# EAGLE design nRF2401A-Chip-v11 (EAGLE 6.4)
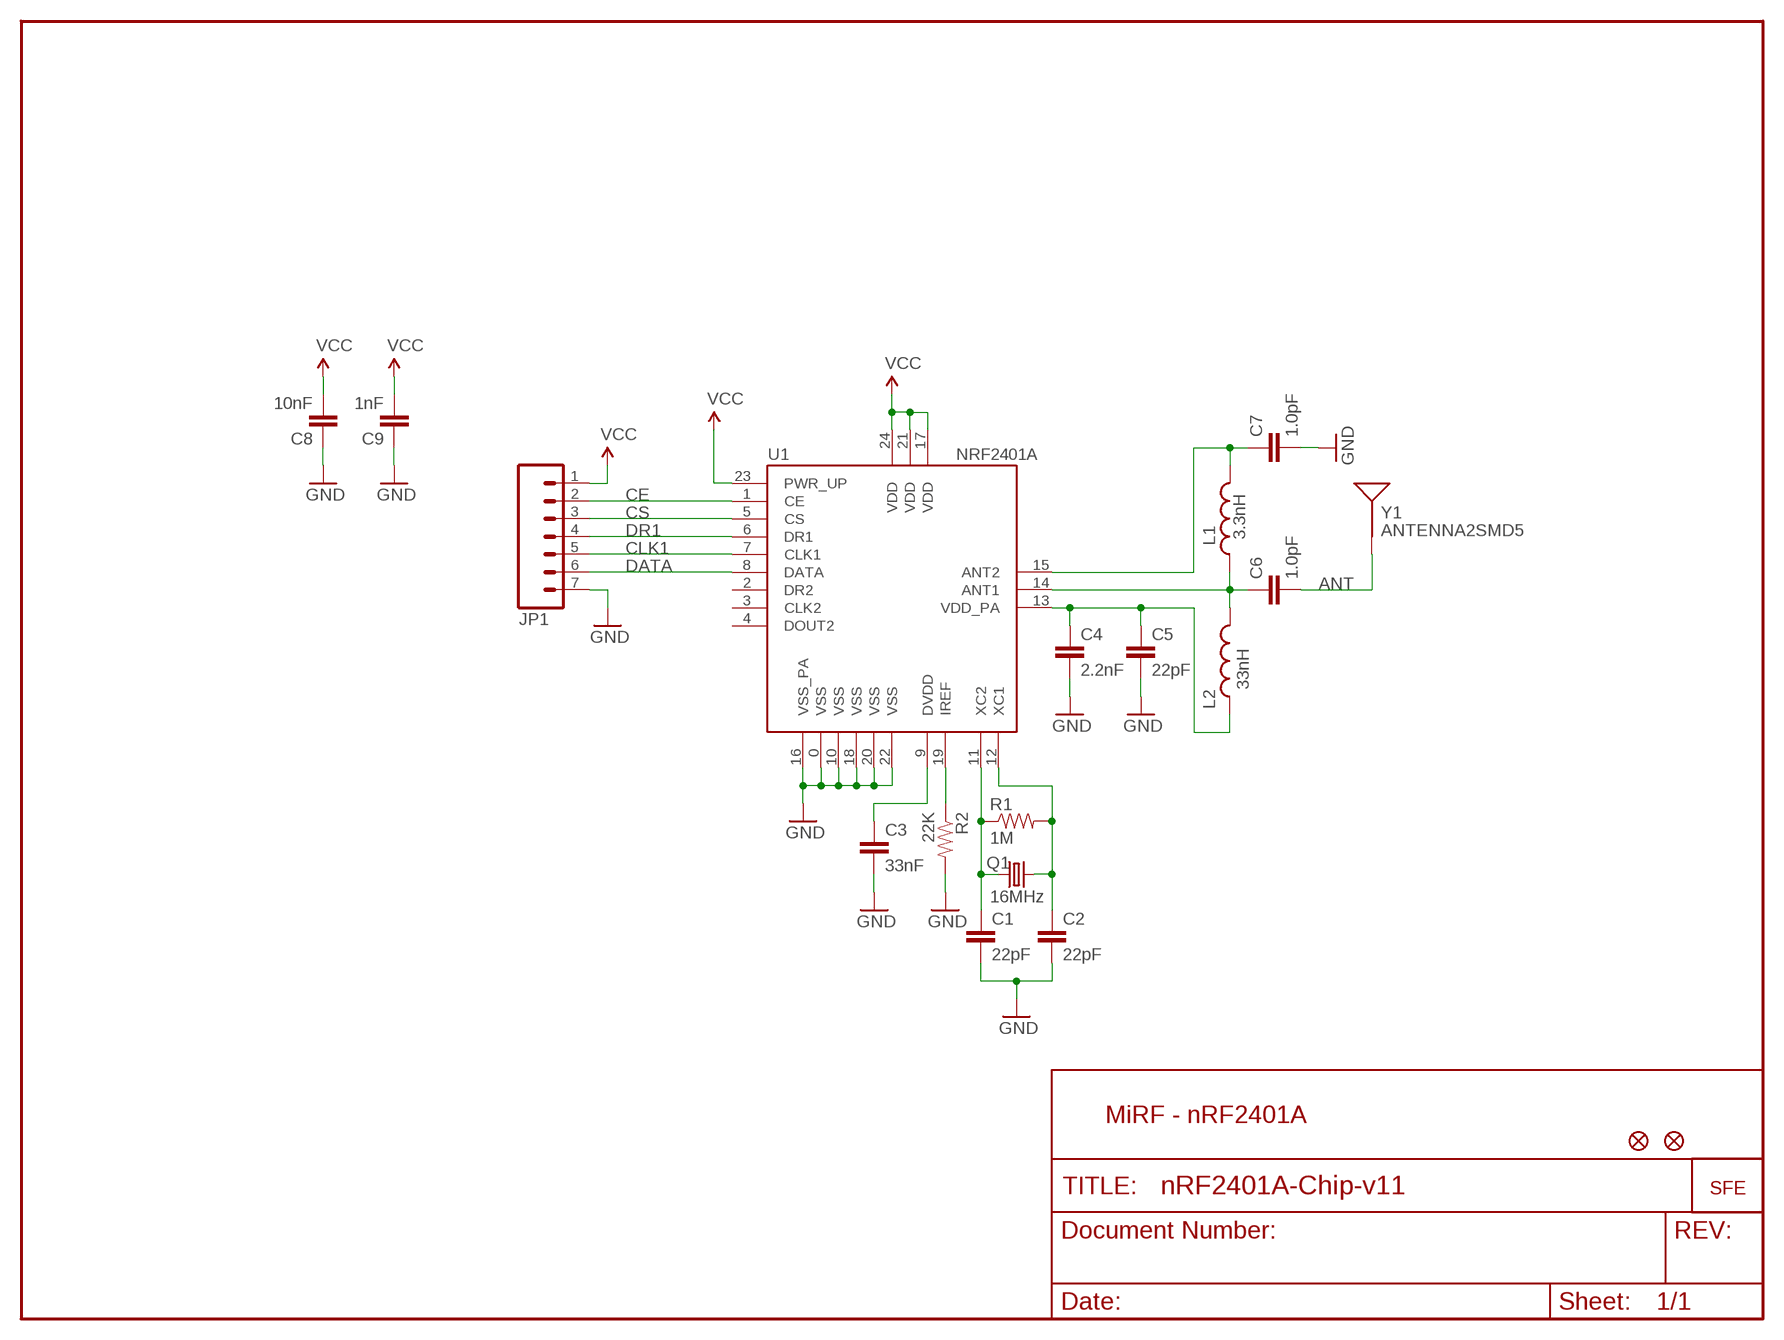
[diagram p0: schematic, sheet 1]

## Parts
C1  22pF  CAP0402  [C0402]
C2  22pF  CAP0402  [C0402]
C3  33nF  CAP0402  [C0402]
C4  2.2nF  CAP0402  [C0402]
C5  22pF  CAP0402  [C0402]
C6  1.0pF  CAP0402  [C0402]
C7  1.0pF  CAP0402  [C0402]
C8  10nF  CAP0402  [C0402]
C9  1nF  CAP0402  [C0402]
JP1  M07  [1X07]
JP2  FIDUCIALUFIDUCIAL  [MICRO-FIDUCIAL]
JP3  FIDUCIALUFIDUCIAL  [MICRO-FIDUCIAL]
L1  3.3nH  INDUCTOR0402  [C0402]
L2  33nH  INDUCTOR0402  [C0402]
Q1  16MHz  CRYSTAL5X3  [CRYSTAL-SMD-5X3]
R1  1M  RESISTOR0402  [C0402]
R2  22K  RESISTOR0402  [C0402]
U1  NRF2401A  NRF2401ASMD  [MLP-24]
U$1  LOGO-SFESK  [SFE-LOGO-FLAME]
Y1  ANTENNA2SMD5  [ANTENNA-CHIP5]

## Nets
ANT: C6.2 Y1.FEED(SIGNAL)
CE: JP1.2 U1.1(CE)
CLK1: JP1.5 U1.7(CLK1)
CS: JP1.3 U1.5(CS)
DATA: JP1.6 U1.8(DATA)
DR1: JP1.4 U1.6(DR1)
GND: C1.2 C2.2 C3.2 C4.2 C5.2 C7.2 C8.1 C9.1 JP1.7 R2.2 U1.0(VSS) U1.10(VSS) U1.16(VSS_PA) U1.18(VSS) U1.20(VSS) U1.22(VSS)
N$1: C1.1 Q1.1 R1.1 U1.11(XC2)
N$2: C2.1 Q1.3 R1.2 U1.12(XC1)
N$3: C6.1 L1.1 L2.2 U1.14(ANT1)
N$4: R2.1 U1.19(IREF)
N$5: C3.1 U1.9(DVDD)
N$6: C7.1 L1.2 U1.15(ANT2)
N$7: C4.1 C5.1 L2.1 U1.13(VDD_PA)
VCC: C8.2 C9.2 JP1.1 U1.17(VDD) U1.21(VDD) U1.23(PWR_UP) U1.24(VDD)
Unconnected: U1.2(DR2) U1.3(CLK2) U1.4(DOUT2)

## Notes on the sheet
- MiRF - nRF2401A

## Library data of the parts
C1-C9 = SparkFun:CAP: Capacitor Standard 0603 ceramic capacitor, and 0.1" leaded capacitor.
JP1 = SparkFun:M07: Header 7 Standard 7-pin 0.1" header. Use with straight break away headers (SKU : PRT-00116), right angle break away headers (PRT-00553), swiss pins (PRT-00743), machine pins (PRT-00117), and female headers (PRT-00115).
JP2 JP3 = SparkFun:FIDUCIAL: Fiducial Alignment Points Various fiducial points for machine vision alignment.
L1 L2 = SparkFun:INDUCTOR: Inductors Basic Inductor/Choke - 0603 and 1206. Footprints are not proven and vary greatly between part numbers.
Q1 = SparkFun:CRYSTAL: Crystals Various standard crystals. Proven footprints. Spark Fun Electronics SKU : COM-00534
R1 R2 = SparkFun:RESISTOR: Resistor Basic schematic elements and footprints for 0603, 1206, and PTH 1/10th watt (small) resistors.
U1 = SparkFun:NRF2401A: 2.4GHz Transceiver This is the very popular, low power RF transceiver from Nordic Semiconductor. Used in the Nike+iPod product. SKU: COM-00300
U$1 = SparkFun:LOGO-SFE: Spark Fun Electronics PCB Logo This is the standard Spark Fun Electronics PCB logo.
Y1 = SparkFun:ANTENNA2: Antenna Single endded antenna. Common with smaller chip antennas. CHIP4 package is the GPS Chip Antenna SKU: GPS-08418. CHIP5 package is 2.4GHz chip antenna SKU: WRL-00144.

## Board
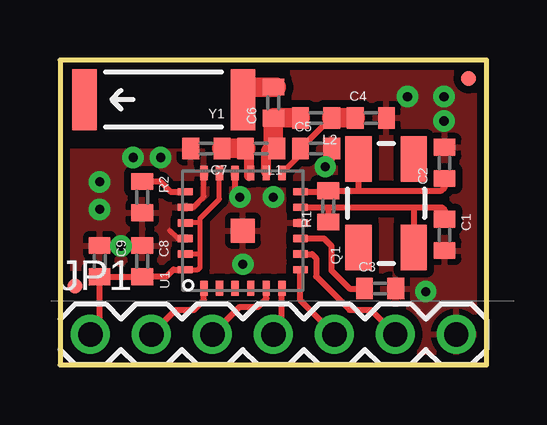
[diagram p1: board, top side]
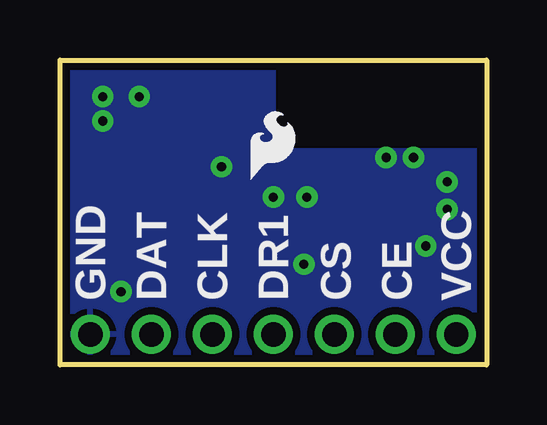
[diagram p2: board, bottom side, seen from below]

Size 17.78 x 12.7 mm. Coordinates in mm from the lower left corner, seen from the top.
Outline: 0,0 17.78,0 17.78,12.7 0,12.7 0,0
Copper layers (1*16): Top 0.035mm / dielectric 1.5mm / Bottom 0.035mm
Design rules "SparkFun *": minimum track width 8mil, minimum drill 15mil, track to track 8mil, track to pad 8mil, pad to pad 8mil, via to via 8mil, smd to smd 8mil, copper to edge 10mil, drill to drill 8mil, minimum pad ring 12mil, minimum via ring 10mil, stop-mask expansion 4mil, vias tented up to drill 20mil, thermal gap 10mil

### Footprints (pad centres in the part's own frame; a part is rotated, then mirrored left to right if it is on the bottom)
C0402 = smd 0.7 x 0.9: 1 -0.65,0; 2 0.65,0
1X07 = drill 1.016: 1 0,0; 2 2.54,0; 3 5.08,0; 4 7.62,0; 5 10.16,0; 6 12.7,0; 7 15.24,0
MICRO-FIDUCIAL = smd 0.635 x 0.635: 1 0,0
CRYSTAL-SMD-5X3 = smd 1.9 x 1.1: 1 -1.85,-1.15; 2 1.85,-1.15; 3 1.85,1.15; 4 -1.85,1.15
MLP-24 = smd 1 x 1: 0 0,0 | smd 0.61 x 0.305: 1 -2.401,1.625; 2 -2.401,0.975; 3 -2.401,0.325; 4 -2.401,-0.325; 5 -2.401,-0.975; 6 -2.401,-1.625; 13 2.401,-1.625; 14 2.401,-0.975; 15 2.401,-0.325; 16 2.401,0.325; 17 2.401,0.975; 18 2.401,1.625 | smd 0.305 x 0.61: 7 -1.625,-2.401; 8 -0.975,-2.401; 9 -0.325,-2.401; 10 0.325,-2.401; 11 0.975,-2.401; 12 1.625,-2.401; 19 1.625,2.401; 20 0.975,2.401; 21 0.325,2.401; 22 -0.325,2.401; 23 -0.975,2.401; 24 -1.625,2.401
ANTENNA-CHIP5 = smd 1.016 x 2.54: FEED -3.302,0; NC 3.302,0

### Placement (x,y rotation side)
C1  16.02,5.41 270 top
C2  16.02,8.41 90 top
C3  13.34,3.17 0 top
C4  12.95,10.29 0 top
C5  10.67,9.02 0 top
C6  8.89,10.92 90 top
C7  6.1,9.02 180 top
C8  3.43,4.32 270 top
C9  1.65,4.32 270 top
JP1  1.27,1.27 0 top
JP2  17.02,11.94 0 top
JP3  0.64,3.28 0 top
L1  8.38,9.02 180 top
L2  10.67,10.29 180 top
Q1  13.59,6.73 90 top
R1  11.18,6.6 90 top
R2  3.43,6.99 270 top
U1  7.62,5.59 90 top
U$1  9.84,7.73 0 bottom
Y1  4.32,11.05 180 top

### Tracks (layer width: path | path; a pad name or v marks a point on that pad's centre or on a via)
ANT
  Top 0.813: 8.9,11.56 9.02,11.56 | 8.9,11.56 C6.2 | Y1.FEED 7.87,11.56 8.9,11.56
CE
  Top 0.254: U1.1 6,2.69 5.59,2.29 4.83,2.29 JP1.2
CLK1
  Top 0.254: U1.7 10.02,2.68 JP1.5
CS
  Top 0.254: U1.5 8.6,2.75 8.26,2.41 7.49,2.41 JP1.3
DATA
  Top 0.254: U1.8 10.5,4.61 10.67,4.45 10.67,3.68 12.06,2.29 12.95,2.29 JP1.6
DR1
  Top 0.254: U1.6 9.24,1.62 JP1.4
GND  (via drill 0.38)
  Top 0.203: C1.2 15.86,4.59 | 3.72,6.45 R2.2 3.7,6.6 | 5.23,6.6 U1.20 5.55,6.56 6,7.01 U1.18 | U1.22 4.9,5.26 4.57,5.59 | C9.1 2.52,4.97 v2.54,4.95 3.43,4.95 C8.1
  Top 0.254: U1.16 7.29,7.18 v7.49,6.99 | C5.2 11.32,8.52 v11.05,8.26
  other vias: 16,10.16 15.24,3.05 14.48,11.18 7.62,4.19 8.89,6.99 3.05,8.64 1.65,7.62 1.65,6.48 16,11.18 4.19,8.64
  pour Top (isolate 0.305): 0,0 0,8.89 8.89,8.89 8.89,12.7 17.78,12.7 17.78,0
  pour Bottom (isolate 0.305): 0,0 0,8.89 8.89,8.89 8.89,12.7 17.78,12.7 17.78,0
N$1
  Top 0.203: C1.1 16.02,6.2
  Top 0.254: C1.1 16.02,6.46 15.92,6.56 14.73,6.56 | U1.11 11.18,6.56 | 11.18,6.56 14.73,6.56 | 14.73,6.56 14.73,6.48 14.74,6.47 Q1.1 | 11.18,6.56 R1.1
N$2
  Top 0.254: U1.12 11.15,7.21 R1.2 12.45,7.25 | C2.1 16.02,7.39 15.89,7.25 12.45,7.25 | 12.45,7.25 12.45,7.37 12.44,7.37 Q1.3
N$3
  Top 0.203: L1.1 8.89,9.14 | L2.2 9.91,10.29 | C6.1 8.9,10.29
  Top 0.406: L1.1 8.64,9.02 8.6,8.98 U1.14
  Top 0.813: 8.89,9.14 C6.1 | 8.9,10.29 L2.2
N$4
  Top 0.254: U1.19 4.6,7.21 4.19,7.62 3.81,7.62 3.81,7.63 R2.1
N$5
  Top 0.254: U1.9 10.99,5.26 11.3,4.95 11.3,3.94 12.06,3.17 C3.1
N$6
  Top 0.203: 7.87,7.87 7.88,7.87 U1.15 | L1.2 7.87,8.88
  Top 0.406: 7.87,8.88 7.87,7.87
  Top 0.813: C7.1 L1.2
N$7
  Top 0.203: 12.45,10.29 12.19,10.41 C4.1 | 11.3,10.29 L2.1 | C5.1 10.02,8.77 | 10.06,8.99 10.03,9.02 C5.1 | C5.1 10.01,9.02 10.01,8.75 U1.13
  Top 0.254: 10.03,9.02 11.3,10.29
  Top 0.813: L2.1 C4.1
VCC
  Top 0.203: U1.24 5.74,3.96 5.84,4.06 5.84,4.57 | 5.84,4.57 5.84,5.97 | U1.21 5.79,5.91 5.84,5.97 | U1.23 5.8,4.61 5.84,4.57 | 5.84,5.97 5.84,6.1 6.64,6.9 U1.17
  Top 0.254: C9.2 1.65,3.68 1.67,3.67 | 1.67,3.67 C8.2 3.43,3.68 4.45,3.68 4.72,3.96 U1.24 | 1.67,3.67 1.67,1.67 JP1.1

### Text on the board
bPlace: VCC | CE | CS | DR1 | CLK | DAT | GND
tValues: nRF2401A w/ Chip Antenna